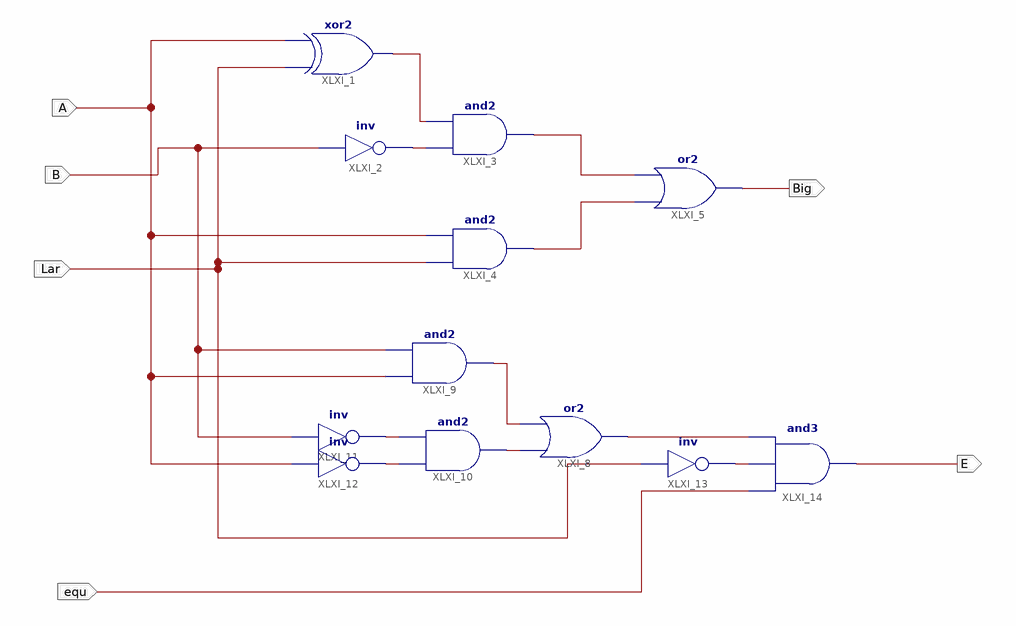
[diagram p0: schematic sheet 1]
// Xilinx ISE schematic compa.sch (kintex7) as structural Verilog: 12 symbols, 6 ports
module compa (
  input  A,
  input  B,
  input  Lar,
  input  equ,
  output Big,
  output E
);

  wire XLXN_1, XLXN_2, XLXN_3, XLXN_4, XLXN_12, XLXN_13, XLXN_14, XLXN_21, XLXN_22, XLXN_24;

  xor XLXI_1 (XLXN_4, Lar, A);
  not XLXI_2 (XLXN_3, B);
  and XLXI_3 (XLXN_1, XLXN_3, XLXN_4);
  and XLXI_4 (XLXN_2, Lar, A);
  or XLXI_5 (Big, XLXN_2, XLXN_1);
  or XLXI_8 (XLXN_12, XLXN_13, XLXN_14);
  and XLXI_9 (XLXN_14, A, B);
  and XLXI_10 (XLXN_13, XLXN_22, XLXN_21);
  not XLXI_11 (XLXN_21, B);
  not XLXI_12 (XLXN_22, A);
  not XLXI_13 (XLXN_24, Lar);
  and XLXI_14 (E, equ, XLXN_24, XLXN_12);
endmodule
